# EAGLE design power_supply (EAGLE 7.3.0)
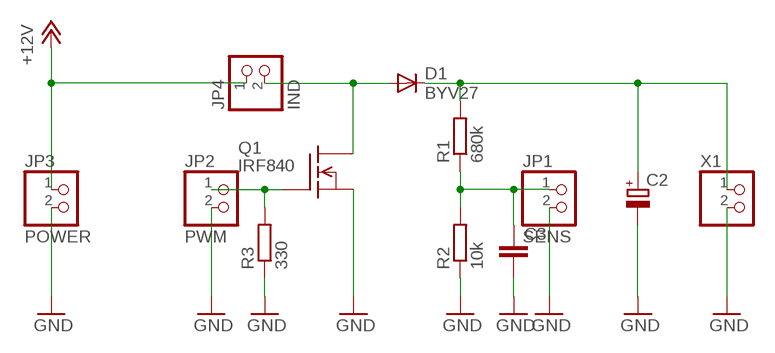
[diagram p0: schematic, sheet 1]

## Parts
C2  CPOL-EUE5-10,5  [E5-10,5]
C3  C-EU102-043X133  [C102-043X133]
D1  BYV27  BYV277  [SOD57]
JP1  SENS  PINHD-1X2  [1X02]
JP2  PWM  PINHD-1X2  [1X02]
JP3  POWER  PINHD-1X2  [1X02]
JP4  IND  PINHD-1X2  [1X02]
Q1  IRF840  IRF840A  [TO220-A]
R1  680k  R-EU_  [0207/7]
R2  10k  R-EU_  [0207/7]
R3  330  R-EU_  [0207/7]
X1  W237-102  [W237-102]

## Nets
180: C2.+ D1.C R1.2 X1.1
+12V: JP3.1 JP4.1
GND: C2.- C3.2 JP1.2 JP2.2 JP3.2 Q1.3(S) R2.1 R3.1 X1.2
IND: D1.A JP4.2 Q1.2(D)
PWM: JP2.1 Q1.1(G) R3.2
SENS: C3.1 JP1.1 R1.1 R2.2

## Library data of the parts
C2 = nixie_tube:CPOL-EU: POLARIZED CAPACITOR, European symbol
C3 = nixie_tube:C-EU: CAPACITOR, European symbol
D1 = nixie_tube:BYV27: DIODE ultra fast
JP1-JP4 = nixie_tube:PINHD-1X2: PIN HEADER
Q1 = nixie_tube:IRF840: N-Channel Enhancement MOSFET (HEXFET); 500V; 8A; 0,85Ohm
R1-R3 = nixie_tube:R-EU_: RESISTOR, European symbol
X1 = nixie_tube:W237-102: WAGO SCREW CLAMP

## Board
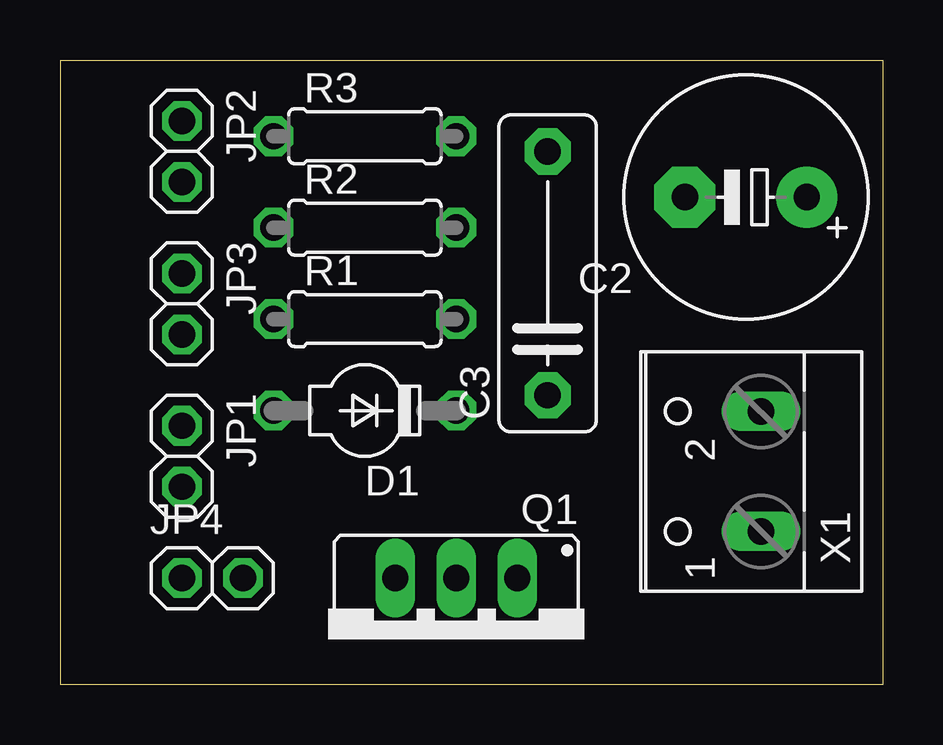
[diagram p1: board, top side]
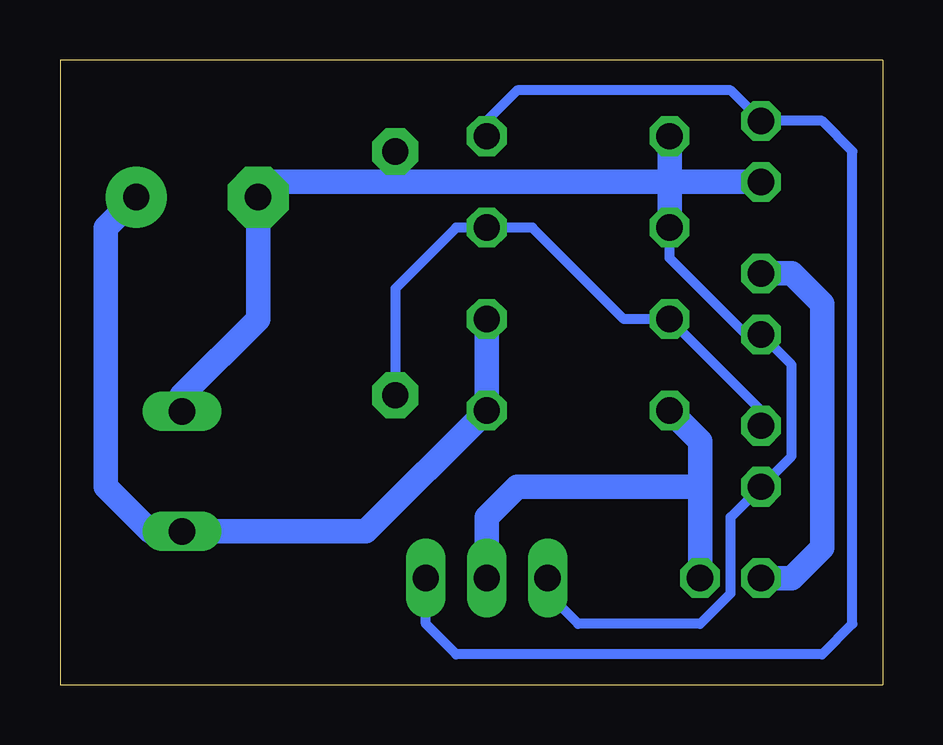
[diagram p2: board, bottom side, seen from below]

Size 34.29 x 26.04 mm. Coordinates in mm from the lower left corner, seen from the top.
Outline: 0,26.02 0,0 34.29,0 34.29,26.04 0,26.04
Copper layers (1*16): Top 0.035mm / dielectric 1.5mm / Bottom 0.035mm
Design rules "default": minimum track width 10mil, minimum drill 24mil, track to track 8mil, track to pad 8mil, pad to pad 8mil, via to via 8mil, smd to smd 8mil, copper to edge 40mil, drill to drill 8mil, minimum pad ring 10mil, minimum via ring 8mil, stop-mask expansion 4mil, vias tented up to drill 0mil, thermal gap 10mil

### Footprints (pad centres in the part's own frame; a part is rotated, then mirrored left to right if it is on the bottom)
E5-10,5 = drill 1.1 pad 2.54: + -2.54,0 | drill 1.1 pad 2.54 octagon: - 2.54,0
C102-043X133 = drill 1.1 pad 1.93 octagon: 1 -5.08,0; 2 5.08,0
SOD57 = drill 1.1 octagon: A 3.81,0; C -3.81,0
1X02 = drill 1.1 octagon: 1 -1.27,0; 2 1.27,0
TO220-A = drill 1.1 long: 1 -2.54,0; 2 0,0; 3 2.54,0
0207/7 = drill 1.1 octagon: 1 -3.81,0; 2 3.81,0
W237-102 = drill 1.1 long: 1 -2.5,-1.27; 2 2.5,-1.27

### Placement (x,y rotation side)
C2  28.57,20.32 180 top
C3  20.32,17.14 90 top
D1  12.7,11.43 180 top
JP1  5.08,9.53 270 top
JP2  5.08,22.23 270 top
JP3  5.08,15.88 270 top
JP4  6.35,4.45 0 top
Q1  16.51,4.45 180 top
R1  12.7,15.24 0 top
R2  12.7,19.05 0 top
R3  12.7,22.86 0 top
X1  27.94,8.89 90 top

### Tracks (layer width: path | path; a pad name or v marks a point on that pad's centre or on a via)
180
  Bottom 1.016: R1.2 D1.C 21.55,6.39 X1.1 30.52,6.39 32.38,8.26 32.38,19.05 C2.+
+12V
  Bottom 1.016: JP4.1 3.81,4.45 2.54,5.71 2.54,15.88 3.81,17.14 JP3.1
GND
  Bottom 0.406: R2.1 8.89,17.78 5.71,14.61 JP3.2 3.81,13.34 3.81,9.53 JP1.2 6.35,6.99 6.35,3.81 7.62,2.54 12.7,2.54 13.97,3.81 Q1.3
  Bottom 1.016: X1.2 29.21,12.06 26.04,15.24 C2.- 25.4,20.95 20.32,20.95 | 20.32,20.95 C3.2 | 8.89,20.95 JP2.2 | 8.89,20.95 20.32,20.95 | 8.89,20.95 R3.1 | R2.1 8.89,20.95
IND
  Bottom 1.016: JP4.2 7.62,8.26 | 7.62,8.26 7.62,10.16 D1.A | Q1.2 16.51,6.99 15.24,8.26 7.62,8.26
PWM
  Bottom 0.406: R3.2 16.51,23.5 15.24,24.77 6.35,24.77 JP2.1 2.54,23.5 1.27,22.23 1.27,2.54 2.54,1.27 17.78,1.27 19.05,2.54 Q1.1
SENS
  Bottom 0.406: C3.1 20.32,16.51 17.78,19.05 R2.2 14.61,19.05 10.79,15.24 R1.1 5.08,11.43 JP1.1